# EAGLE design pico_clone (EAGLE 9.6.2)
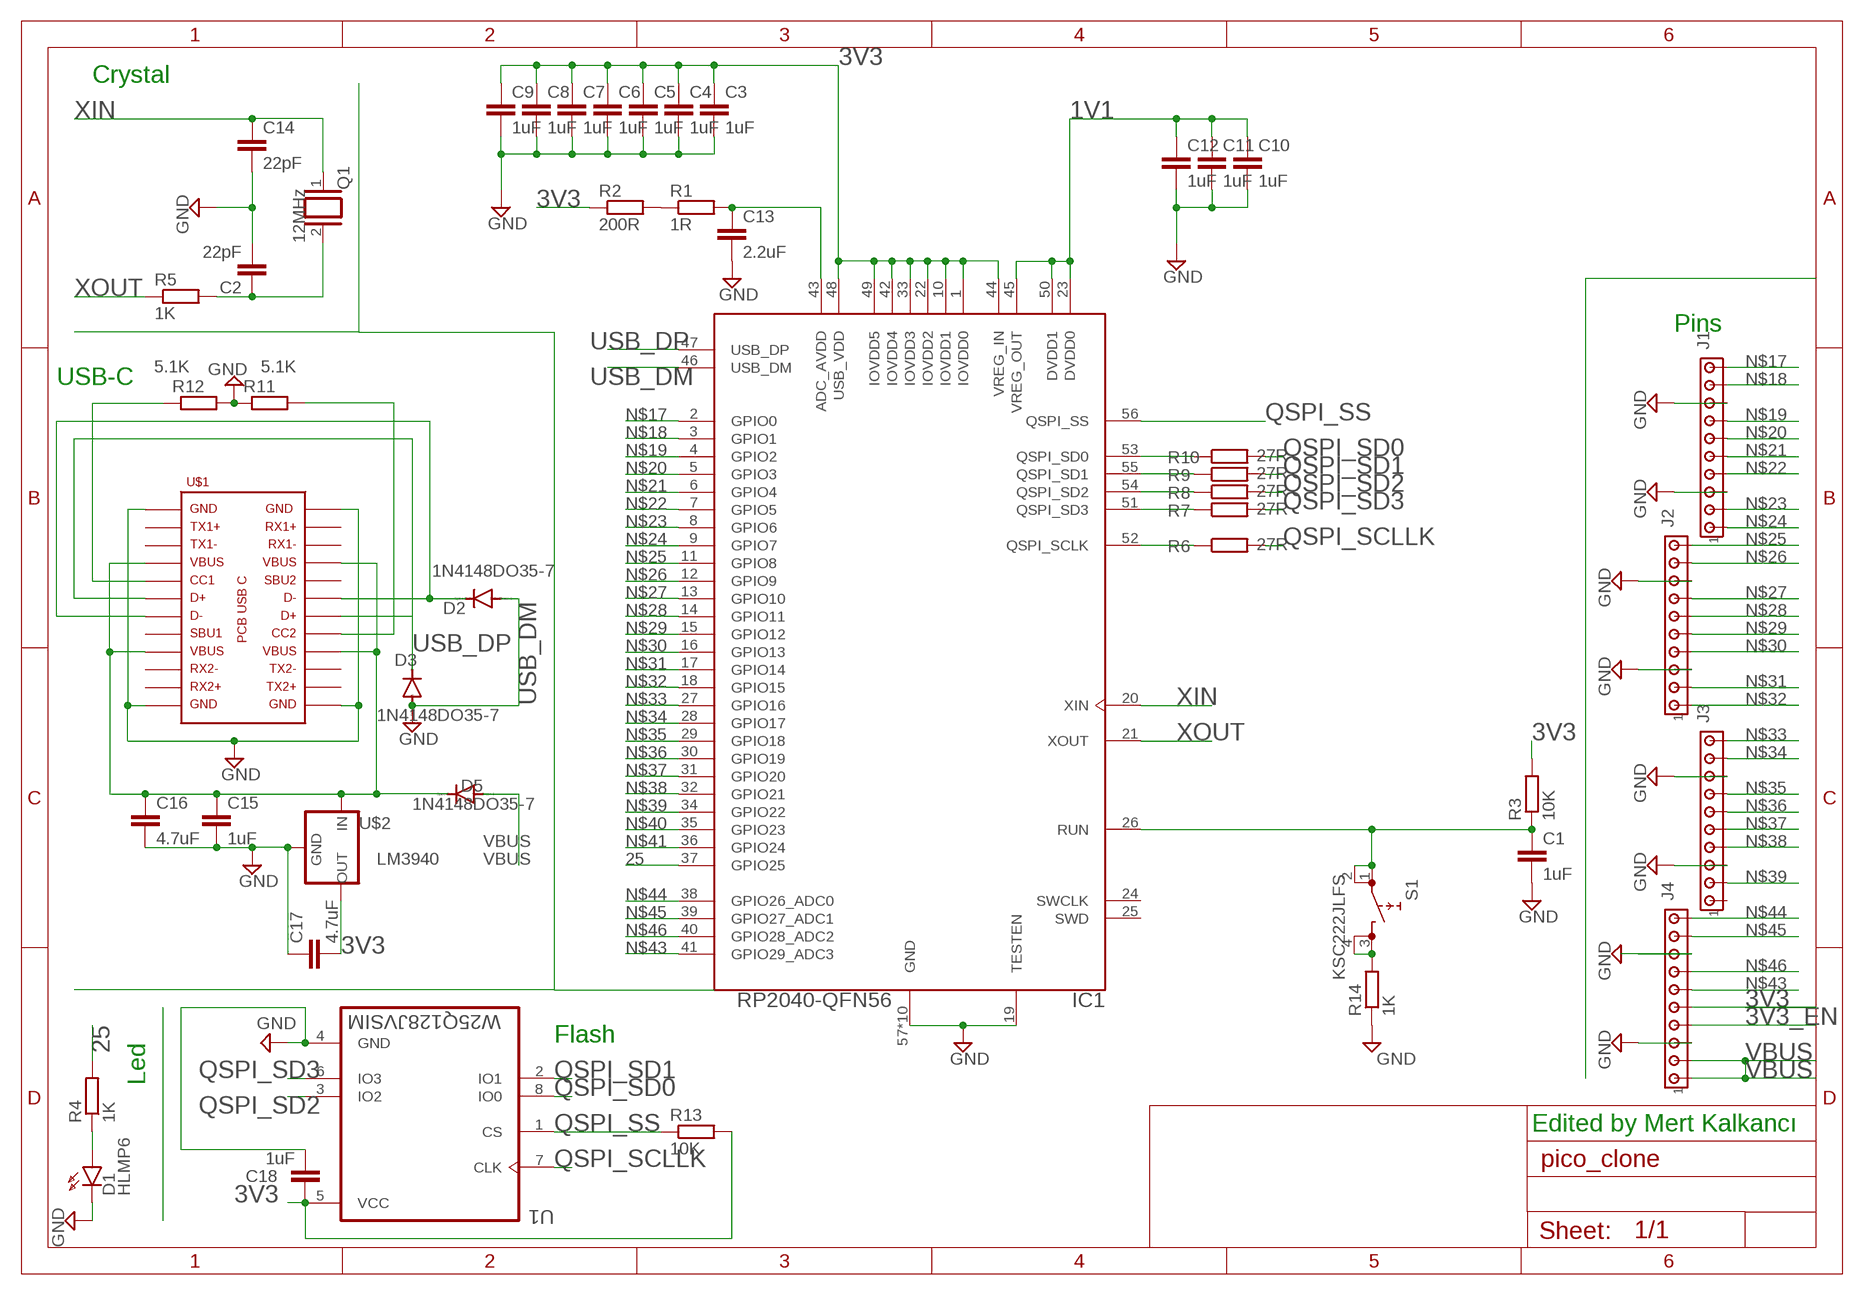
[diagram p0: schematic, sheet 1]

## Parts
C1  1uF  C2,5-3  [C2.5-3]
C2  22pF  C2,5-3  [C2.5-3]
C3  1uF  C2,5-3  [C2.5-3]
C4  1uF  C2,5-3  [C2.5-3]
C5  1uF  C2,5-3  [C2.5-3]
C6  1uF  C2,5-3  [C2.5-3]
C7  1uF  C2,5-3  [C2.5-3]
C8  1uF  C2,5-3  [C2.5-3]
C9  1uF  C2,5-3  [C2.5-3]
C10  1uF  C2,5-3  [C2.5-3]
C11  1uF  C2,5-3  [C2.5-3]
C12  1uF  C2,5-3  [C2.5-3]
C13  2.2uF  C2,5-3  [C2.5-3]
C14  22pF  C2,5-3  [C2.5-3]
C15  1uF  C2,5-3  [C2.5-3]
C16  4.7uF  C2,5-3  [C2.5-3]
C17  4.7uF  C2,5-3  [C2.5-3]
C18  1uF  C2,5-3  [C2.5-3]
D1  HLMP6  [HLMP6]
D2  1N4148DO35-7  [DO35-7]
D3  1N4148DO35-7  [DO35-7]
D5  1N4148DO35-7  [DO35-7]
IC1  RP2040-QFN56  [RP2040-QFN-56]
J1  MTA10-100  [10X10MTA]
J2  MTA10-100  [10X10MTA]
J3  MTA10-100  [10X10MTA]
J4  MTA10-100  [10X10MTA]
Q1  12MHz  XTAL/S  [QS]
R1  1R  R-EU_M0805  [M0805]
R2  200R  R-EU_M0805  [M0805]
R3  10K  R-EU_M0805  [M0805]
R4  1K  R-EU_M0805  [M0805]
R5  1K  R-EU_M0805  [M0805]
R6  27R  R-EU_M0805  [M0805]
R7  27R  R-EU_M0805  [M0805]
R8  27R  R-EU_M0805  [M0805]
R9  27R  R-EU_M0805  [M0805]
R10  27R  R-EU_M0805  [M0805]
R11  5.1K  R-EU_M0805  [M0805]
R12  5.1K  R-EU_M0805  [M0805]
R13  10K  R-EU_M0805  [M0805]
R14  1K  R-EU_M0805  [M0805]
S1  KSC222JLFS  [KSC222JLFS]
U1  W25Q128JVSIM  [SOIC127P790X216-8N]
U$1  PCB_USB_CDS_3  [USB_TYPE_C_DS_3]
U$2  LM3940  [TO220]

## Nets
1V1: C10.1 C11.1 C12.1 IC1.23(DVDD0) IC1.45(VREG_OUT) IC1.50(DVDD1)
3V3: C3.1 C4.1 C5.1 C6.1 C7.1 C8.1 C9.1 C17.2 C18.1 IC1.1(IOVDD0) IC1.10(IOVDD1) IC1.22(IOVDD2) IC1.33(IOVDD3) IC1.42(IOVDD4) IC1.44(VREG_IN) IC1.48(USB_VDD) IC1.49(IOVDD5) J4.5 R2.1 R3.2 R13.2 U1.5(VCC) U$2.3(OUT)
3V3_EN: J4.4
25: IC1.37(GPIO25) R4.2
GND: C1.2 C2.2 C3.2 C4.2 C5.2 C6.2 C7.2 C8.2 C9.2 C10.2 C11.2 C12.2 C13.2 C14.2 C15.2 C16.2 C17.1 C18.2 D1.K D2.A D3.A IC1.19(TESTEN) IC1.57(GND) IC1.58(GND) IC1.59(GND) IC1.60(GND) IC1.61(GND) IC1.62(GND) IC1.63(GND) IC1.64(GND) IC1.65(GND) IC1.66(GND) J1.3 J1.8 J2.3 J2.8 J3.3 J3.8 J4.3 R11.1 R12.2 R14.1 U1.4(GND) U$1.A1 U$1.A12 U$1.B1 U$1.B12 U$2.2(GND)
N$1: R1.1 R2.2
N$3: C13.1 IC1.43(ADC_AVDD) R1.2
N$4: IC1.52(QSPI_SCLK) R6.1
N$5: D1.A R4.1
N$7: C2.1 Q1.2 R5.2
N$9: IC1.51(QSPI_SD3) R7.1
N$10: IC1.54(QSPI_SD2) R8.1
N$11: IC1.55(QSPI_SD1) R9.1
N$12: IC1.53(QSPI_SD0) R10.1
N$13: J4.8 ; supply symbol labelled GND
N$14: C15.1 C16.1 D5.C U$1.A4 U$1.A9 U$1.B4 U$1.B9 U$2.1(IN)
N$15: R11.2 U$1.B5
N$16: R12.1 U$1.A5
N$17: IC1.2(GPIO0) J1.10
N$18: IC1.3(GPIO1) J1.9
N$19: IC1.4(GPIO2) J1.7
N$20: IC1.5(GPIO3) J1.6
N$21: IC1.6(GPIO4) J1.5
N$22: IC1.7(GPIO5) J1.4
N$23: IC1.8(GPIO6) J1.2
N$24: IC1.9(GPIO7) J1.1
N$25: IC1.11(GPIO8) J2.10
N$26: IC1.12(GPIO9) J2.9
N$27: IC1.13(GPIO10) J2.7
N$28: IC1.14(GPIO11) J2.6
N$29: IC1.15(GPIO12) J2.5
N$30: IC1.16(GPIO13) J2.4
N$31: IC1.17(GPIO14) J2.2
N$32: IC1.18(GPIO15) J2.1
N$33: IC1.27(GPIO16) J3.10
N$34: IC1.28(GPIO17) J3.9
N$35: IC1.29(GPIO18) J3.7
N$36: IC1.30(GPIO19) J3.6
N$37: IC1.31(GPIO20) J3.5
N$38: IC1.32(GPIO21) J3.4
N$39: IC1.34(GPIO22) J3.2
N$40: IC1.35(GPIO23)
N$41: IC1.36(GPIO24)
N$42: R14.2 S1.3 S1.4
N$43: IC1.41(GPIO29_ADC3) J4.6
N$44: IC1.38(GPIO26_ADC0) J4.10
N$45: IC1.39(GPIO27_ADC1) J4.9
N$46: IC1.40(GPIO28_ADC2) J4.7
QSPI_SCLLK: R6.2 U1.7(CLK)
QSPI_SD0: R10.2 U1.8(IO0)
QSPI_SD1: R9.2 U1.2(IO1)
QSPI_SD2: R8.2 U1.3(IO2)
QSPI_SD3: R7.2 U1.6(IO3)
QSPI_SS: IC1.56(QSPI_SS) R13.1 U1.1(CS)
RST: C1.1 IC1.26(RUN) R3.1 S1.1 S1.2
USB_DM: D2.C IC1.46(USB_DM) U$1.A7 U$1.B7
USB_DP: D3.C IC1.47(USB_DP) U$1.A6 U$1.B6
VBUS: D5.A J4.1 J4.2
XIN: C14.1 IC1.20(XIN) Q1.1
XOUT: IC1.21(XOUT) R5.1
Unconnected: IC1.24(SWCLK) IC1.25(SWD) J3.1 U$1.A2 U$1.A3 U$1.A8 U$1.A10 U$1.A11 U$1.B2 U$1.B3 U$1.B8 U$1.B10 U$1.B11

## Notes on the sheet
- Crystal
- Pins
- USB-C
- Led | Flash
- Edited by Mert Kalkancı

## Library data of the parts
C1-C18 = capacitor-wima:C: CAPACITOR naming: grid - package width
D1 = display-hp:HLMP6: LED 2mm horizontal; MF: AGILENT TECHNOLOGIES; MPN: HLMP-6500; OC_FARNELL: 1652490; OC_NEWARK: 40K0088
D2 D3 D5 = diode:1N4148: DIODE high speed (Philips)
IC1 = RpiPico:RP2040-QFN56
J1-J4 = con-amp:MTA10-100: AMP connector
Q1 = special:XTAL/S: CRYSTAL
R1-R14 = rcl:R-EU_: RESISTOR, European symbol; SPICEPREFIX: R
S1 = Switch:KSC222JLFS: SWITCH TACTILE SPST-NO 0.05A 32V Manufacturer's datasheet <https://dznh3ojzb2azq.cloudfront.net/products/Tactile/KSC2/documents/datasheet.pdf>; CREATED_BY: PCBLayout.com; DIGIKEY_PARTNO: CKN9195TR-ND; MANUFACTURER: C&K; MPN: KSC222J LFS
U1 = W25Q128JVSIM:W25Q128JVSIM: None Check availability <https://pricing.snapeda.com/parts/W25Q128JVSIM/Winbond%20Electronics/view-part?ref=eda>; AVAILABILITY: In Stock; CHECK_PRICES: https://www.snapeda.com/parts/W25Q128JVSIM/Winbond+Electronics/view-part/?ref=eda; DESCRIPTION: FLASH - NOR Memory IC 128Mb (16M x 8) SPI - Quad I/O, QPI, DTR 133 MHz 8-SOIC; MF: Winbond Electronics; MP: W25Q128JVSIM; PACKAGE: SOIC-8 Winbond Electronics; PRICE: None; PURCHASE-URL: https://pricing.snapeda.com/search?q=W25Q128JVSIM&ref=eda; SNAPEDA_LINK: https://www.snapeda.com/parts/W25Q128JVSIM/Winbond+Electronics/view-part/?ref=snap
U$1 = USB_pcb_connectors:PCB_USB_C
U$2 = LM3940:LM3940: LM3940 1A Low Dropout Regulator for 5V to 3.3V Conversion Check availability <https://pricing.snapeda.com/parts/LM3940/Texas%20Instruments/view-part?ref=eda>; AVAILABILITY: Not in stock; CHECK_PRICES: https://www.snapeda.com/parts/LM3940/Texas+Instruments/view-part/?ref=eda; DESCRIPTION: Linear Voltage Regulator IC Positive Fixed 1 Output 1A DDPAK/TO-263-3; MF: Texas Instruments; MP: LM3940; PACKAGE: None; PRICE: None; SNAPEDA_LINK: https://www.snapeda.com/parts/LM3940/Texas+Instruments/view-part/?ref=snap

## Board
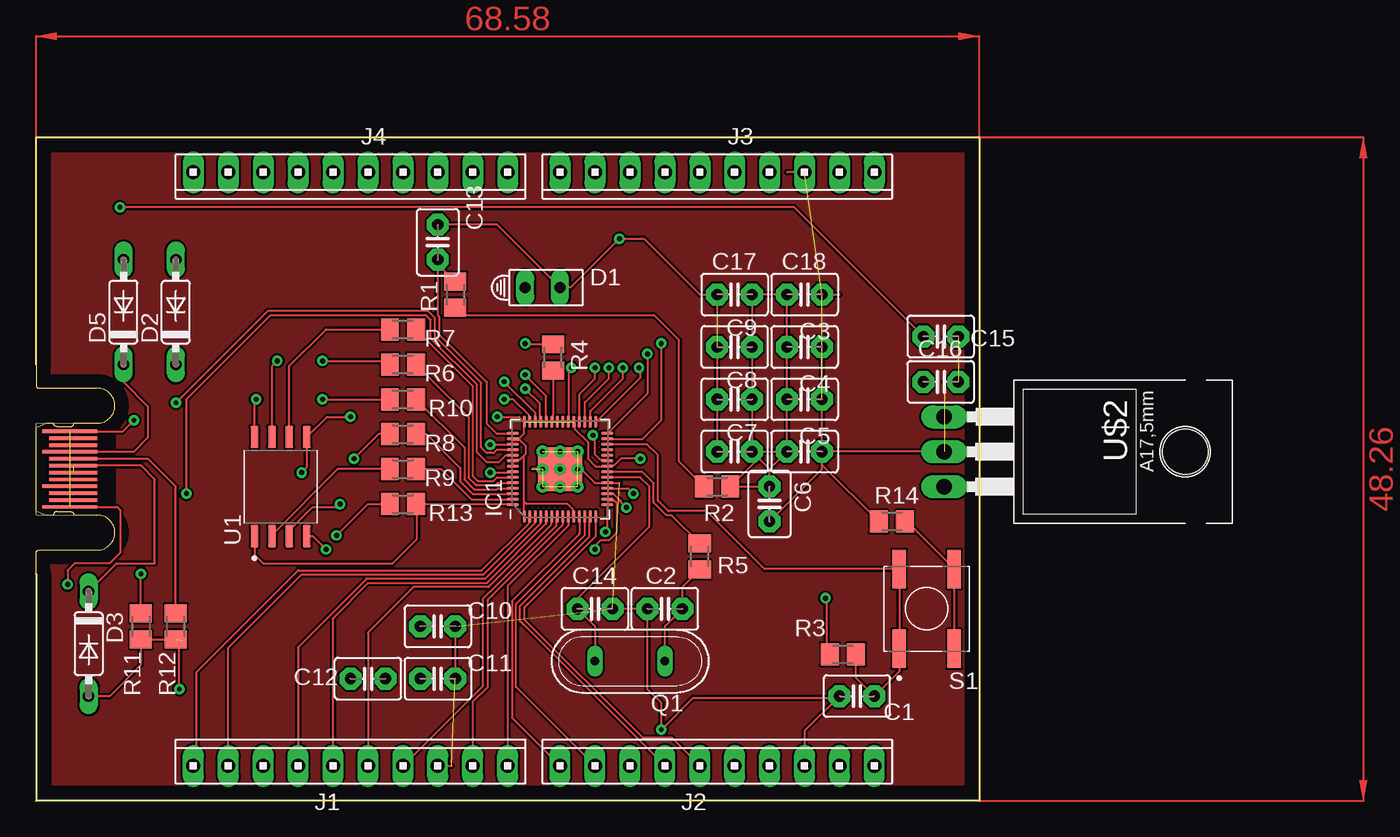
[diagram p1: board, top side]
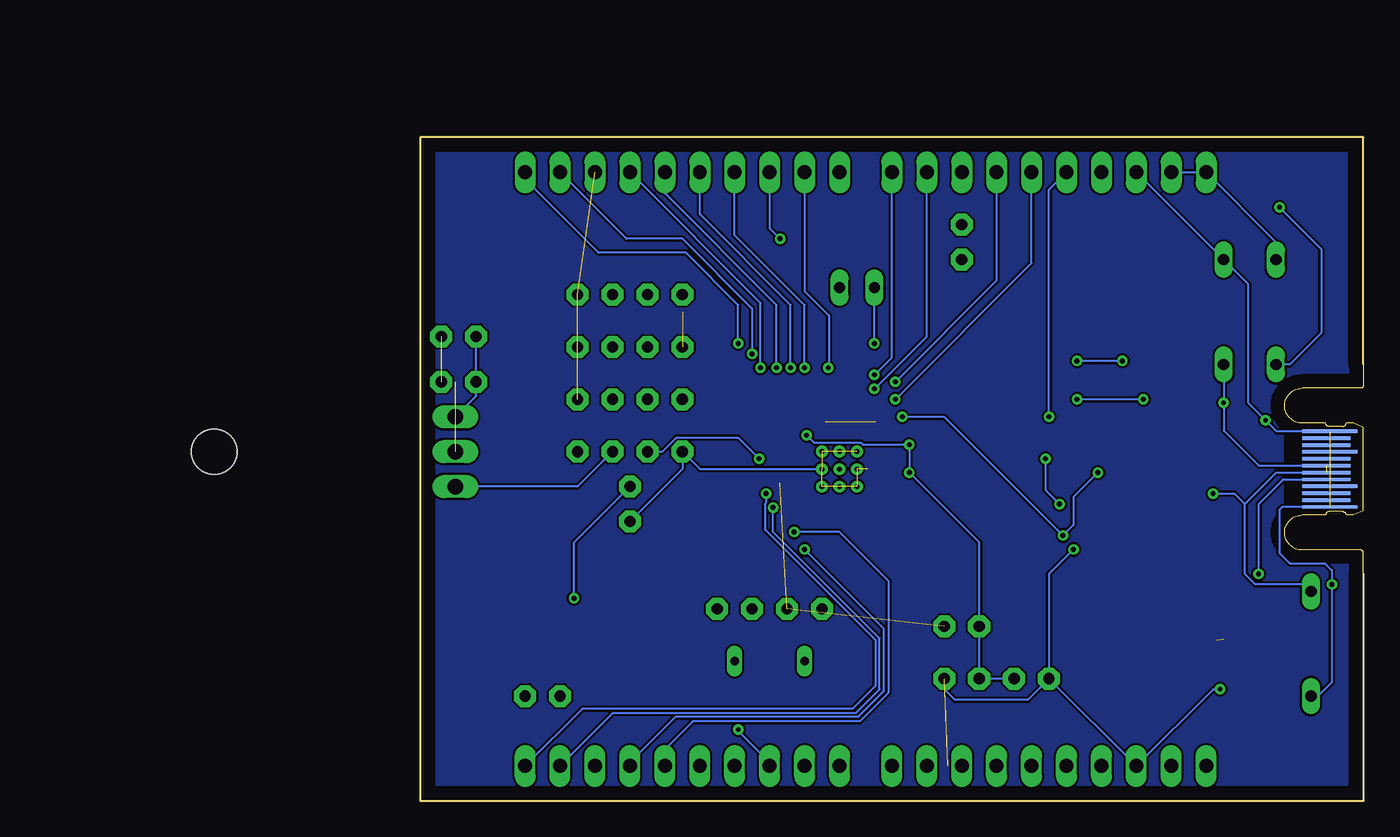
[diagram p2: board, bottom side, seen from below]

Size 68.58 x 48.26 mm. Coordinates in mm from the lower left corner, seen from the top.
Outline: 0,16.51 0,0 68.58,0 68.58,48.26 0,48.26 0,31.75
Copper layers (1*16): Top 0.035mm / dielectric 1.5mm / Bottom 0.035mm
Design rules "default": minimum track width 6mil, minimum drill 0.35mm, track to track 6mil, track to pad 6mil, pad to pad 6mil, via to via 6mil, smd to smd 6mil, copper to edge 40mil, drill to drill 6mil, minimum pad ring 10mil, minimum via ring 8mil, stop-mask expansion 4mil, vias tented up to drill 0mil, thermal gap 10mil

### Footprints (pad centres in the part's own frame; a part is rotated, then mirrored left to right if it is on the bottom)
C2.5-3 = drill 0.813 pad 1.6 octagon: 1 -1.27,0; 2 1.27,0
HLMP6 = drill 0.813 long: A -1.27,0; K 1.27,0
DO35-7 = drill 0.813 long: A 3.81,0; C -3.81,0
RP2040-QFN-56 = smd 0.875 x 0.2: 1 -3.438,2.6; 2 -3.438,2.2; 3 -3.438,1.8; 4 -3.438,1.4; 5 -3.438,1; 6 -3.438,0.6; 7 -3.438,0.2; 8 -3.438,-0.2; 9 -3.438,-0.6; 10 -3.438,-1; 11 -3.438,-1.4; 12 -3.438,-1.8; 13 -3.438,-2.2; 14 -3.438,-2.6; 29 3.438,-2.6; 30 3.438,-2.2; 31 3.438,-1.8; 32 3.438,-1.4; 33 3.438,-1; 34 3.438,-0.6; 35 3.438,-0.2; 36 3.438,0.2; 37 3.438,0.6; 38 3.438,1; 39 3.438,1.4; 40 3.438,1.8; 41 3.438,2.2; 42 3.438,2.6 | smd 0.2 x 0.875: 15 -2.6,-3.438; 16 -2.2,-3.438; 17 -1.8,-3.438; 18 -1.4,-3.438; 19 -1,-3.438; 20 -0.6,-3.438; 21 -0.2,-3.438; 22 0.2,-3.438; 23 0.6,-3.438; 24 1,-3.438; 25 1.4,-3.438; 26 1.8,-3.438; 27 2.2,-3.438; 28 2.6,-3.438; 43 2.6,3.438; 44 2.2,3.438; 45 1.8,3.438; 46 1.4,3.438; 47 1,3.438; 48 0.6,3.438; 49 0.2,3.438; 50 -0.2,3.438; 51 -0.6,3.438; 52 -1,3.438; 53 -1.4,3.438; 54 -1.8,3.438; 55 -2.2,3.438; 56 -2.6,3.438 | smd 3.2 x 3.2: 57 0,0 | drill 0.35 pad 0.6: 58 -1.275,1.275; 59 0,1.275; 60 1.275,1.275; 61 -1.275,0; 62 0,0; 63 1.275,0; 64 -1.275,-1.275; 65 0,-1.275; 66 1.275,-1.275
10X10MTA = drill 1.016 long: 1 11.43,0; 2 8.89,0; 3 6.35,0; 4 3.81,0; 5 1.27,0; 6 -1.27,0; 7 -3.81,0; 8 -6.35,0; 9 -8.89,0; 10 -11.43,0
QS = drill 0.61 long: 1 -2.54,0; 2 2.54,0
M0805 = smd 1.3 x 1.6: 1 -0.95,0; 2 0.95,0
KSC222JLFS = smd 2.8 x 1: 1 -2.9,2; 2 2.9,2; 3 2.9,-2; 4 -2.9,-2
SOIC127P790X216-8N = smd 1.61 x 0.58: 1 -3.605,1.905; 2 -3.605,0.635; 3 -3.605,-0.635; 4 -3.605,-1.905; 5 3.605,-1.905; 6 3.605,-0.635; 7 3.605,0.635; 8 3.605,1.905
USB_TYPE_C_DS_3 = smd 0.25 x 4: A1 2.75,-2.45; A4 1.25,-2.45; A9 -1.25,-2.45; A12 -2.75,-2.45 | smd 0.25 x 3.5: A2 2.25,-2.7; A3 1.75,-2.7; A5 0.75,-2.7; A6 0.25,-2.7; A7 -0.25,-2.7; A8 -0.75,-2.7; A10 -1.75,-2.7; A11 -2.25,-2.7 | smd 0.25 x 4 bottom: B1 -2.75,-2.45; B4 -1.25,-2.45; B9 1.25,-2.45; B12 2.75,-2.45 | smd 0.25 x 3.5 bottom: B2 -2.25,-2.7; B3 -1.75,-2.7; B5 -0.75,-2.7; B6 -0.25,-2.7; B7 0.25,-2.7; B8 0.75,-2.7; B10 1.75,-2.7; B11 2.25,-2.7
TO220 = drill 1.118 long: 1 -2.54,-10.16; 2 0,-10.16; 3 2.54,-10.16 | hole 3.302: 0,7.366

### Placement (x,y rotation side)
C1  59.69,7.62 180 top
C2  45.72,13.97 180 top
C3  55.88,33.02 0 top
C4  55.88,29.21 0 top
C5  55.88,25.4 0 top
C6  53.34,21.59 270 top
C7  50.8,25.4 180 top
C8  50.8,29.21 180 top
C9  50.8,33.02 180 top
C10  29.21,12.7 0 top
C11  29.21,8.89 0 top
C12  24.13,8.89 180 top
C13  29.21,40.64 90 top
C14  40.64,13.97 0 top
C15  65.79,33.78 0 top
C16  65.79,30.48 0 top
C17  50.8,36.83 0 top
C18  55.88,36.83 0 top
D1  36.83,37.34 0 top
D2  10.16,35.56 90 top
D3  3.81,11.43 270 top
D5  6.35,35.56 90 top
IC1  38.1,24.13 90 top
J1  22.86,2.54 0 top
J2  49.53,2.54 0 top
J3  49.53,45.72 180 top
J4  22.86,45.72 180 top
Q1  43.18,10.16 0 top
R1  30.48,36.83 90 top
R2  49.53,22.86 180 top
R3  58.67,10.67 180 top
R4  37.59,32.26 270 top
R5  48.26,17.78 270 top
R6  26.67,31.75 180 top
R7  26.67,34.29 180 top
R8  26.67,26.67 180 top
R9  26.67,24.13 180 top
R10  26.67,29.21 180 top
R11  7.62,12.7 90 top
R12  10.16,12.7 270 top
R13  26.67,21.59 180 top
R14  62.23,20.32 0 top
S1  64.77,13.97 90 top
U1  17.78,22.86 90 top
U$1  0,24.13 90 top
U$2  76.2,25.4 270 top

### Tracks (layer width: path | path; a pad name or v marks a point on that pad's centre or on a via)
1V1  (via drill 0.35)
  Top 0.152: IC1.23 41.47,24.8 41.03,24.8 40.64,25.2 40.64,26.45 v40.49,26.6 | v33.02,25.91 33.04,25.93 IC1.45 | v33.02,23.88 34.61,23.88 IC1.50
  Bottom 0.152: v40.49,26.6 39.96,26.06 36.55,26.06 36.4,25.91 v33.02,25.91 v33.02,23.88 27.94,18.8 C10.1 C11.1 C12.1
3V3  (via drill 0.35)  (1 unrouted)
  Top 0.152: IC1.33 39.17,27.5 39.17,27.06 40.13,26.1 40.13,24.89 40.69,24.33 IC1.22 41.61,24.4 42.04,24.4 42.53,24.89 v43.94,24.89 | 35.5,25.14 35.16,24.8 34.73,24.8 IC1.48 IC1.49 | v19.3,23.88 19.68,24.26 U1.5 21.16,27.94 v22.86,27.94 | v21.84,19.3 24.13,21.59 R13.2 | C7.1 C8.1 C9.1 C17.2 C18.1 C3.1 C4.1 C5.1 | C7.1 C5.1 | 53.34,24.13 C5.1 | 53.34,24.13 C6.1 R2.1 52.2,24.58 52.2,25.27 | 53.34,24.13 52.2,25.27 | 52.2,25.27 C7.1 | R3.2 57.47,10.92 57.47,14.67 v57.4,14.73 | IC1.1 35.5,21.75 | 35.5,21.75 35.5,25.14 | 35.5,25.14 35.58,25.22 35.58,25.84 35.16,26.26 34.73,26.26 IC1.44 34.73,26.4 35.16,26.4 35.5,26.74 IC1.42 35.13,27.94 v33.53,27.94 | IC1.10 39.03,20.76 39.03,21.2 38.63,21.59 35.66,21.59 35.5,21.75
  Bottom 0.152: v19.3,23.88 21.08,22.1 21.08,20.07 v21.84,19.3 30.48,27.94 v33.53,27.94 | v57.4,14.73 57.4,18.8 C6.1 | C5.1 57.15,22.86 U$2.3 | v22.86,27.94 22.86,44.45 J4.5 | C7.1 50.98,25.4 49.96,26.43 45.48,26.43 v43.94,24.89
25
  Top 0.152: R4.2 37.59,28.09 37.57,28.07 37.57,27.64 IC1.37
GND  (via drill 0.35)  (20 unrouted)
  Top 0.152: J3.8 54.61,45.72 | C16.2 66.04,30.48 | C15.2 66.04,33.78 | U$2.2 C5.2 | C5.2 C3.2 | C9.2 C8.2 C7.2 | J1.3 30.23,2.54 | D3.A 5.33,7.62 7.62,9.91 R11.1 10.41,11.75 | 36.07,24.13 IC1.62 39.62,24.13 40.64,23.11 41.52,23.11 IC1.19 42.4,23.13 42.42,23.11 | C18.2 58.42,36.83 | U$1.A12 5.89,21.38 6.1,21.17 6.1,18.03 5.33,17.27 2.79,17.27 2.29,16.76 v2.29,15.75 | U$1.A1 6.31,26.88 v7.11,27.69 | 49.53,35.56 C17.1 48.26,36.83 44.2,40.89 v42.42,40.89 38.86,37.34 D1.K 33.53,41.91 C13.2 | C6.2 57.15,24.13 C5.2 | C5.2 57.15,24.45 R14.1 | C1.2 58.29,7.49 | 58.29,7.49 55.88,5.08 J2.3 | 58.29,7.49 47.77,7.49 v45.47,5.18 45.47,7.11 44.45,8.13 C2.2 C14.2 | C10.2 C11.2 | 10.41,11.75 10.6,11.75 10.67,11.68 | v10.41,8.13 10.41,11.75 | U1.4 20.11,19.25 v21.08,18.29
  Bottom 0.152: U$1.A12 5.89,21.38 6.1,21.17 6.1,18.03 5.33,17.27 2.79,17.27 2.29,16.76 v2.29,15.75 2.29,8.64 3.3,7.62 D3.A | U$1.A1 6.31,26.88 8.38,28.96 8.38,37.59 D2.A J4.3 | J3.3 43.18,41.66 v42.42,40.89 | IC1.65 48.26,24.13 C7.2 49.53,24.13 C6.2 | J2.8 43.18,2.79 45.47,5.08 v45.47,5.18 | C12.2 24.38,7.37 29.72,7.37 30.48,8.13 C11.2 | C12.2 J1.8 10.92,8.13 v10.41,8.13 | v21.08,18.29 22.86,16.51 C12.2
GND_BOTTOM
  pour Bottom: 5.84,18.29 0,18.29 0,0 68.58,0 68.58,48.26 0,48.26 0,29.97 5.84,29.97
GND_UPPER
  pour Top: 0,48.26 0,29.97 5.84,29.97 5.84,18.29 0,18.29 0,0 68.58,0 68.58,48.26
N$1
  Top 0.152: R2.2 46.74,24.7 46.74,33.53 44.96,35.31 31.05,35.31 R1.1
N$3
  Top 0.152: R1.2 29.21,39.05 C13.1 29.21,35.34 29.31,35.23 29.31,33.93 32.77,30.48 32.77,27.43 33.47,26.73 IC1.43
N$4
  Top 0.152: R6.1 31.45,27.92 31.45,23.5 31.98,22.96 33.4,22.96 33.56,23.13 IC1.52
N$5  (via drill 0.35)
  Top 0.152: R4.1 35.63,33.21 v35.56,33.27
  Bottom 0.152: v35.56,33.27 D1.A
N$7
  Top 0.152: Q1.2 45.72,12.7 C2.1 46.99,15.56 R5.2
N$9
  Top 0.152: R7.1 31.75,30.16 31.75,23.62 32.1,23.27 33.27,23.27 33.53,23.53 IC1.51
N$10
  Top 0.152: R8.1 28.38,26.67 30.84,24.22 30.84,23.24 31.75,22.33 IC1.54
N$11
  Top 0.152: R9.1 29.46,24.13 31.66,21.93 IC1.55
N$12
  Top 0.152: R10.1 31.14,25.69 31.14,23.37 31.85,22.66 33.52,22.66 33.59,22.73 IC1.53
N$14  (via drill 0.35)  (3 unrouted)
  Top 0.152: D5.C 6.35,30.48 8.13,28.7 8.13,26.42 7.09,25.38 U$1.A4 | C15.1 55.12,43.18 v6.1,43.18
  Bottom 0.152: U$2.1 64.52,29.46 C16.1 C15.1 | v6.1,43.18 3.05,40.13 3.05,34.04 5.33,31.75 D5.C
N$15  (via drill 0.35)
  Top 0.152: R11.2 v7.62,16.51
  Bottom 0.152: v7.62,16.51 7.62,21.59 5.83,23.38 U$1.B5
N$16
  Top 0.152: R12.1 10.16,22.86 8.14,24.88 U$1.A5
N$17
  Top 0.152: J1.10 11.68,2.79 11.68,9.4 19.05,16.76 32.4,16.76 35.83,20.19 35.83,20.62 IC1.2
N$18
  Top 0.152: J1.9 13.97,11.12 19.3,16.46 32.53,16.46 36.3,20.23 IC1.3
N$19
  Top 0.152: IC1.4 36.63,20.62 36.63,20.13 32.66,16.15 24.03,16.15 19.05,11.18 J1.7
N$20
  Top 0.152: J1.6 21.59,13.28 24.16,15.85 32.78,15.85 37.1,20.17 IC1.5
N$21
  Top 0.152: IC1.6 37.43,20.62 37.43,20.06 32.91,15.54 27.43,15.54 24.13,12.24 J1.5
N$22
  Top 0.152: J1.4 32.51,8.38 32.51,14.73 33.02,15.24 33.03,15.24 37.83,20.03 37.83,20.62 IC1.7
N$23
  Top 0.152: IC1.8 38.3,20.07 33.16,14.93 33.15,14.93 32.82,14.61 32.82,8.26 31.75,7.19 J1.2
N$24
  Top 0.152: IC1.9 38.7,20.04 34.29,15.63 J1.1
N$25
  Top 0.152: IC1.11 39.5,19.43 34.59,14.53 34.59,6.04 J2.10
N$26
  Top 0.152: IC1.12 39.9,19.33 34.9,14.33 34.9,8.28 J2.9
N$27
  Top 0.152: IC1.13 40.23,20.62 40.23,19.22 35.2,14.2 35.2,13.06 35.36,12.9 35.43,12.83 J2.7
N$28
  Top 0.152: IC1.14 40.7,19.26 35.74,14.3 35.66,14.22 35.51,14.07 35.51,13.18 44.12,4.57 46.23,4.57 J2.6
N$29  (via drill 0.35)
  Top 0.152: v41.4,19.56 41.54,19.69 IC1.15
  Bottom 0.152: v41.4,19.56 38.1,19.56 34.54,16 34.54,7.87 36.63,5.79 48.77,5.79 50.8,3.76 J2.5
N$30  (via drill 0.35)
  Top 0.152: IC1.16 41.61,21.86 42.04,21.86 42.2,21.7 42.2,19.5 41.65,18.95 41.05,18.95 40.64,18.54 v40.64,18.29
  Bottom 0.152: v40.64,18.29 34.89,12.53 34.89,7.96 36.75,6.1 50.04,6.1 53.34,2.79 J2.4
N$31  (via drill 0.35)
  Top 0.152: v42.93,21.34 42.51,21.75 42.51,21.82 42,22.33 IC1.17
  Bottom 0.152: J2.2 54.56,6.4 36.92,6.4 35.19,8.13 35.19,11.82 42.93,19.56 v42.93,21.34
N$32  (via drill 0.35)
  Top 0.152: IC1.18 43.06,22.73 v43.43,22.35
  Bottom 0.152: v43.43,22.35 43.43,21.69 43.53,21.59 43.53,19.73 35.5,11.7 35.5,8.38 37.17,6.71 56.79,6.71 J2.1
N$33  (via drill 0.35)
  Top 0.152: IC1.27 44.11,26.33 45.47,27.69 v45.47,33.27 | 60.96,44.96 J3.10
  Bottom 0.152: v45.47,33.27 45.47,36.07 49.28,39.88 55.63,39.88 60.96,45.21 J3.10
N$34  (via drill 0.35)
  Top 0.152: v44.45,32.51 44.45,29.64 IC1.28
  Bottom 0.152: v44.45,32.51 44.45,35.81 49.53,40.89 53.59,40.89 J3.9
N$35  (via drill 0.35)
  Top 0.152: IC1.29 43.94,30.81 43.94,31.5 v43.84,31.5
  Bottom 0.152: v43.84,31.5 43.84,36.22 J3.7
N$36  (via drill 0.35)
  Top 0.152: IC1.30 40.3,28.36 42.67,30.73 v42.67,31.5
  Bottom 0.152: v42.67,31.5 42.67,36.07 50.8,44.2 J3.6
N$37  (via drill 0.35)
  Top 0.152: IC1.31 39.9,28.98 41.66,30.73 v41.66,31.5
  Bottom 0.152: v41.66,31.5 41.66,36.07 48.26,42.67 J3.5
N$38  (via drill 0.35)
  Top 0.152: IC1.32 39.5,29.59 40.64,30.73 v40.64,31.5
  Bottom 0.152: v40.64,31.5 40.64,36.07 45.72,41.15 J3.4
N$39  (via drill 0.35)
  Top 0.152: v38.92,31.5 38.7,31.27 IC1.34
  Bottom 0.152: J3.2 40.64,37.08 38.86,35.31 38.86,31.5 v38.92,31.5
N$42
  Top 0.152: R14.2 63.32,20.32 S1.3 S1.4
N$43  (via drill 0.35)
  Top 0.152: IC1.41 35.83,27.64 35.83,28.07 34.69,29.21 v34.04,29.21
  Bottom 0.152: v34.04,29.21 24.13,39.12 J4.6
N$44  (via drill 0.35)
  Top 0.152: IC1.38 37.1,29.45 v35.56,30.99
  Bottom 0.152: v35.56,30.99 34.29,32.26 J4.10
N$45  (via drill 0.35)
  Top 0.152: IC1.39 36.63,27.64 36.63,28.9 v35.56,29.97
  Bottom 0.152: v35.56,29.97 31.75,33.78 J4.9
N$46  (via drill 0.35)
  Top 0.152: v34.04,30.48 36.27,28.24 36.27,28 36.3,27.97 IC1.40
  Bottom 0.152: J4.7 26.67,37.85 v34.04,30.48
QSPI_SCLLK  (via drill 0.35)
  Top 0.152: U1.7 17.14,31.62 v17.53,32 | v20.83,32 25.47,32 R6.2
  Bottom 0.152: v17.53,32 v20.83,32
QSPI_SD0  (via drill 0.35)
  Top 0.152: U1.8 15.88,29.08 v16,29.21 | v20.83,29.21 R10.2
  Bottom 0.152: v16,29.21 v20.83,29.21
QSPI_SD1
  Top 0.152: U1.2 17.14,19.36 21.91,24.13 R9.2
QSPI_SD2  (via drill 0.35)
  Top 0.152: R8.2 24.89,26.67 v23.11,24.89 | v22.1,21.59 21.84,21.34 20.07,21.34 18.41,19.68 U1.3
  Bottom 0.152: v23.11,24.89 23.11,22.61 v22.1,21.59
QSPI_SD3
  Top 0.152: U1.6 18.41,31.62 21.08,34.29 R7.2
QSPI_SS
  Top 0.152: U1.1 15.88,17.91 16.51,17.27 25.91,17.27 27.69,19.05 27.69,21.52 R13.1 34.6,21.59 IC1.56
RST
  Top 0.152: R3.1 59.62,8.96 C1.1 62.77,9.43 S1.1 S1.2 52.98,16.87 48.77,21.08 45.97,21.08 45.21,21.84 45.21,25.15 44.43,25.93 IC1.26
USB_DM  (via drill 0.35)  (1 unrouted)
  Top 0.152: IC1.46 33.5,25.53 33.27,25.3 32.77,25.3 32.36,25.71 32.36,30.41 29.01,33.77 29.01,35.11 28.49,35.62 16.83,35.62 v10.16,28.96
  Bottom 0.152: D2.C v10.16,28.96 10.16,26.92 7.62,24.38 U$1.B7
USB_DP  (via drill 0.35)
  Top 0.152: D3.C 5.84,17.27 8.64,17.27 8.64,23.37 7.62,24.38 U$1.A6 | IC1.47 34.15,25.13 33.65,24.62 32.78,24.62 32.05,25.35 32.05,30.29 28.7,33.64 28.7,34.98 28.36,35.32 24.98,35.32 24.96,35.31 17.02,35.31 10.92,29.21 v10.92,22.35
  Bottom 0.152: D3.C 4.32,15.75 7.87,15.75 8.64,16.51 8.64,21.59 | U$1.B6 6.35,23.88 8.64,21.59 | v10.92,22.35 9.4,22.35 8.64,21.59
VBUS
  Bottom 0.152: D5.A 6.35,40.64 J4.1 J4.2
XIN
  Top 0.152: Q1.1 40.64,12.7 C14.1 39.37,14.73 44.6,19.96 44.6,22.86 43.93,23.53 IC1.20
XOUT
  Top 0.152: R5.1 46.21,20.78 45.85,20.78 44.91,21.72 44.91,23.11 44.09,23.93 IC1.21
(copper drawn outside any net)
  shapes: Top area x2